# Altium project PCB_Project.PrjPcb
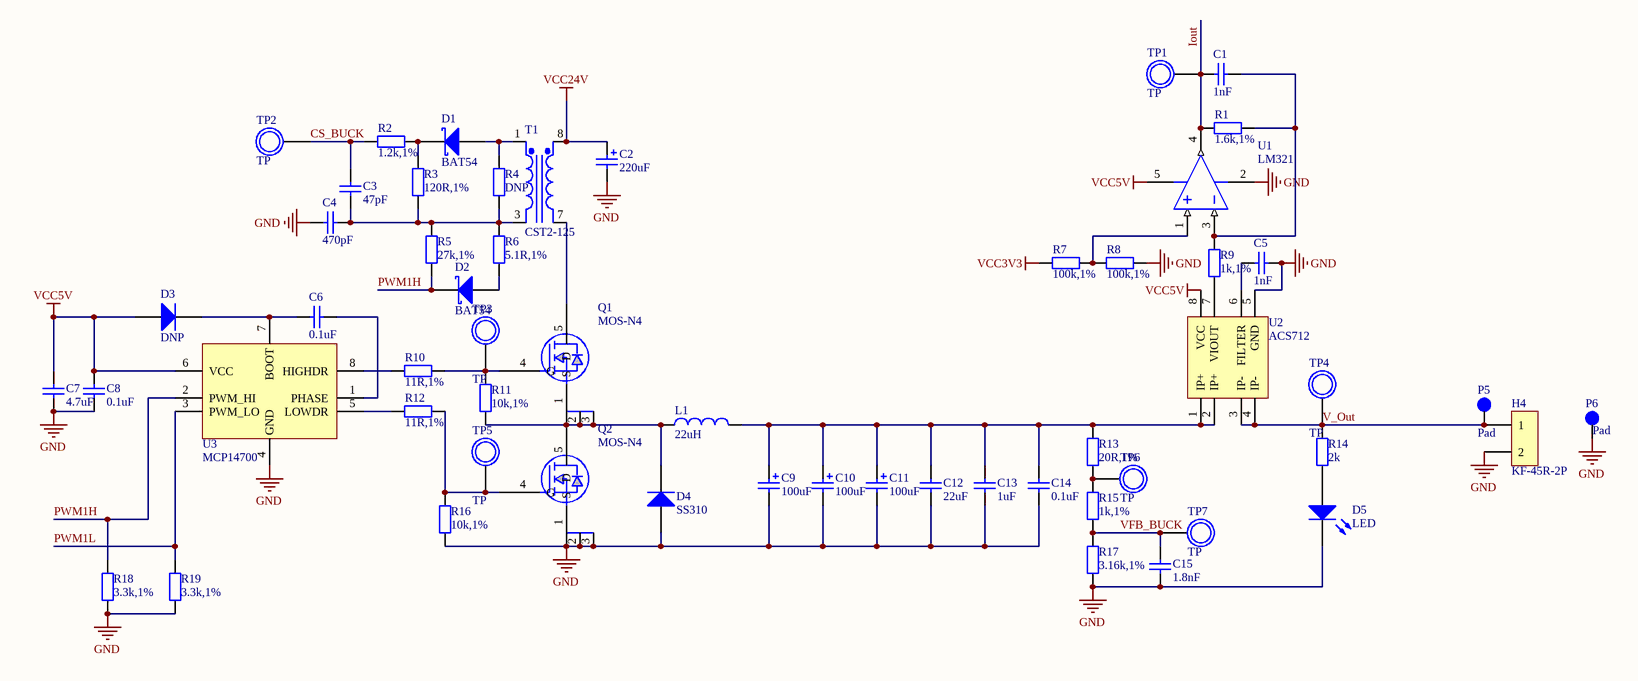
[diagram p0: buck.SchDoc]
2 sheets, 99 parts. Net scope: global (net labels, ports and power ports of the same name join across sheets).
Board file: BuckConverter.PcbDoc
Sheets:
  buck.SchDoc
  dsPIC33EP.SchDoc

## Sheet buck.SchDoc
size A3

### Parts
C1  1nF  [CAP0603]
C2  220uF  [CAPAE109103X105N]
C3  47pF  [CAP0603]
C4  470pF  [CAP0603]
C5  1nF  [CAP0603]
C6  0.1uF  [CAP0603]
C7  4.7uF  [CAP0603]
C8  0.1uF  [CAP0603]
C9  100uF  [CAPAE8983X105N]
C10  100uF  [CAPAE8983X105N]
C11  100uF  [CAPAE8983X105N]
C12  22uF  [CAP1206]
C13  1uF  [CAP1206]
C14  0.1uF  [CAP1206]
C15  1.8nF  [CAP0603]
D1  BAT54  [SOD250X100-2N]
D2  BAT54  [SOD250X100-2N]
D3  DNP  [SMA]
D4  SS310  [SMA]
D5  LED  [LED0402]
H4  KF-45R-2P  [KF-45R-2P]
L1  22uH  [CDRH125]
P5  Pad  [PAD10x50]
P6  Pad  [PAD10x50]
Q1  MOS-N4  [QFN5x6]
Q2  MOS-N4  [QFN5x6]
R1  1.6k,1%  [RES0603]
R2  1.2k,1%  [RES0603]
R3  120R,1%  [RES0603]
R4  DNP  [RES0603]
R5  27k,1%  [RES0603]
R6  5.1R,1%  [RES0603]
R7  100k,1%  [RES0603]
R8  100k,1%  [RES0603]
R9  1k,1%  [RES0603]
R10  11R,1%  [RES0603]
R11  10k,1%  [RES0603]
R12  11R,1%  [RES0603]
R13  20R,1%  [RES0603]
R14  2k  [RES0402]
R15  1k,1%  [RES0603]
R16  10k,1%  [RES0603]
R17  3.16k,1%  [RES0603]
R18  3.3k,1%  [RES0603]
R19  3.3k,1%  [RES0603]
T1  CST2-125  [CST2-125]
TP1  TP  [PAD85R]
TP2  TP  [PAD85R]
TP3  TP  [PAD85R]
TP4  TP  [PAD85R]
TP5  TP  [PAD85R]
TP6  TP  [PAD85R]
TP7  TP  [PAD85R]
U1  LM321  [SOT65P210X110-5N]
U2  ACS712  [SOP127P600X175-8N]
U3  MCP14700  [SOP127P600X175-8N]

### Nets
GND: C2.1 C4.2 C5.1 C7.1 C8.1 C9.1 C10.1 C11.1 C12.1 C13.1 C14.1 C15.1 D4.1(A) D5.2(K) H4.2 P6.1 Q2.1(S) Q2.2 Q2.3 R8.1 R16.2 R17.2 R18.1 R19.1 U1.2(V-) U2.5(GND) U3.4(GND)
VCC3V3: R7.2
VCC5V: C7.2 C8.2 D3.1(A) U1.5(V+) U2.8(VCC) U3.6(VCC)
VCC24V: C2.2 T1.8(Pri+)
CS_BUCK: C3.2 R2.2 TP2.1
Iout: C1.2 R1.1 TP1.1 U1.4(OUT)
PWM1H: D2.1(K) R5.2 R18.2 U3.2(PWM_HI)
PWM1L: R19.2 U3.3(PWM_LO)
V_Out: H4.1 P5.1 R14.2 TP4.1 U2.3(IP-) U2.4(IP-)
VFB_BUCK: C15.2 R15.2 R17.1 TP7.1
NetC1_1: C1.1 R1.2 R9.1 U1.3(IN-)
NetC3_1: C3.1 C4.1 R3.2 R4.1 R5.1 R6.1 T1.3(Sec-)
NetC5_2: C5.2 U2.6(FILTER)
NetC6_1: C6.1 U3.1(PHASE)
NetC6_2: C6.2 D3.2(K) U3.7(BOOT)
NetC9_2: C9.2 C10.2 C11.2 C12.2 C13.2 C14.2 L1.2 R13.1 U2.1(IP+) U2.2(IP+)
NetD1_1: D1.1(K) R2.1 R3.1
NetD1_2: D1.2(A) R4.2 T1.1(Sec+)
NetD2_2: D2.2(A) R6.2
NetD4_2: D4.2(K) L1.1 Q1.1(S) Q1.2 Q1.3 Q2.5(D) R11.2
NetD5_1: D5.1(A) R14.1
NetQ1_4: Q1.4(G) R10.1 R11.1 TP3.1
NetQ1_5: Q1.5(D) T1.7(Pri-)
NetQ2_4: Q2.4(G) R12.1 R16.1 TP5.1
NetR7_1: R7.1 R8.2 U1.1(IN+)
NetR9_2: R9.2 U2.7(VIOUT)
NetR10_2: R10.2 U3.8(HIGHDR)
NetR12_2: R12.2 U3.5(LOWDR)
NetR13_2: R13.2 R15.1 TP6.1

### Library data of the parts
C1 C3-C5 C7 C12 C13 C15 = CAP: CAP NON-POL; Tolerance: +/-10%; Rated Voltage: 50V; Capacitance Value: 0.1uF
C2 C9-C11 = CAP_Pol: cap pol; Tolerance: +\- 10%; Capacitance Value: 47uF; Rated Voltage: 50V
C6 C8 C14 = CAP: CAP NON-POL; Tolerance: +/-10%; Rated Voltage: 50V; Capacitance Value: 0.1uF
D1 D2 = Diode Schottky: Schottky Diode
D3 D4 = Diode
L1 = Inductor
Q1 Q2 = MOS-N4: N Channel MOSFET
R1-R19 = RES
T1 = CST2-125: Current Transformer 1:125
TP1-TP7 = Test_Point: test point
U1 = LM321: Low Power Single Op Amp
U2 = ACS712: Fully Integrated, Hall Effect-Based Linear Current Sensor with 2.1 kVRMS Voltage Isolation and a Low-Resistance Current Conductor
U3 = MCP14700: Dual Input Synchronous MOSFET Driver

## Sheet dsPIC33EP.SchDoc
size A3
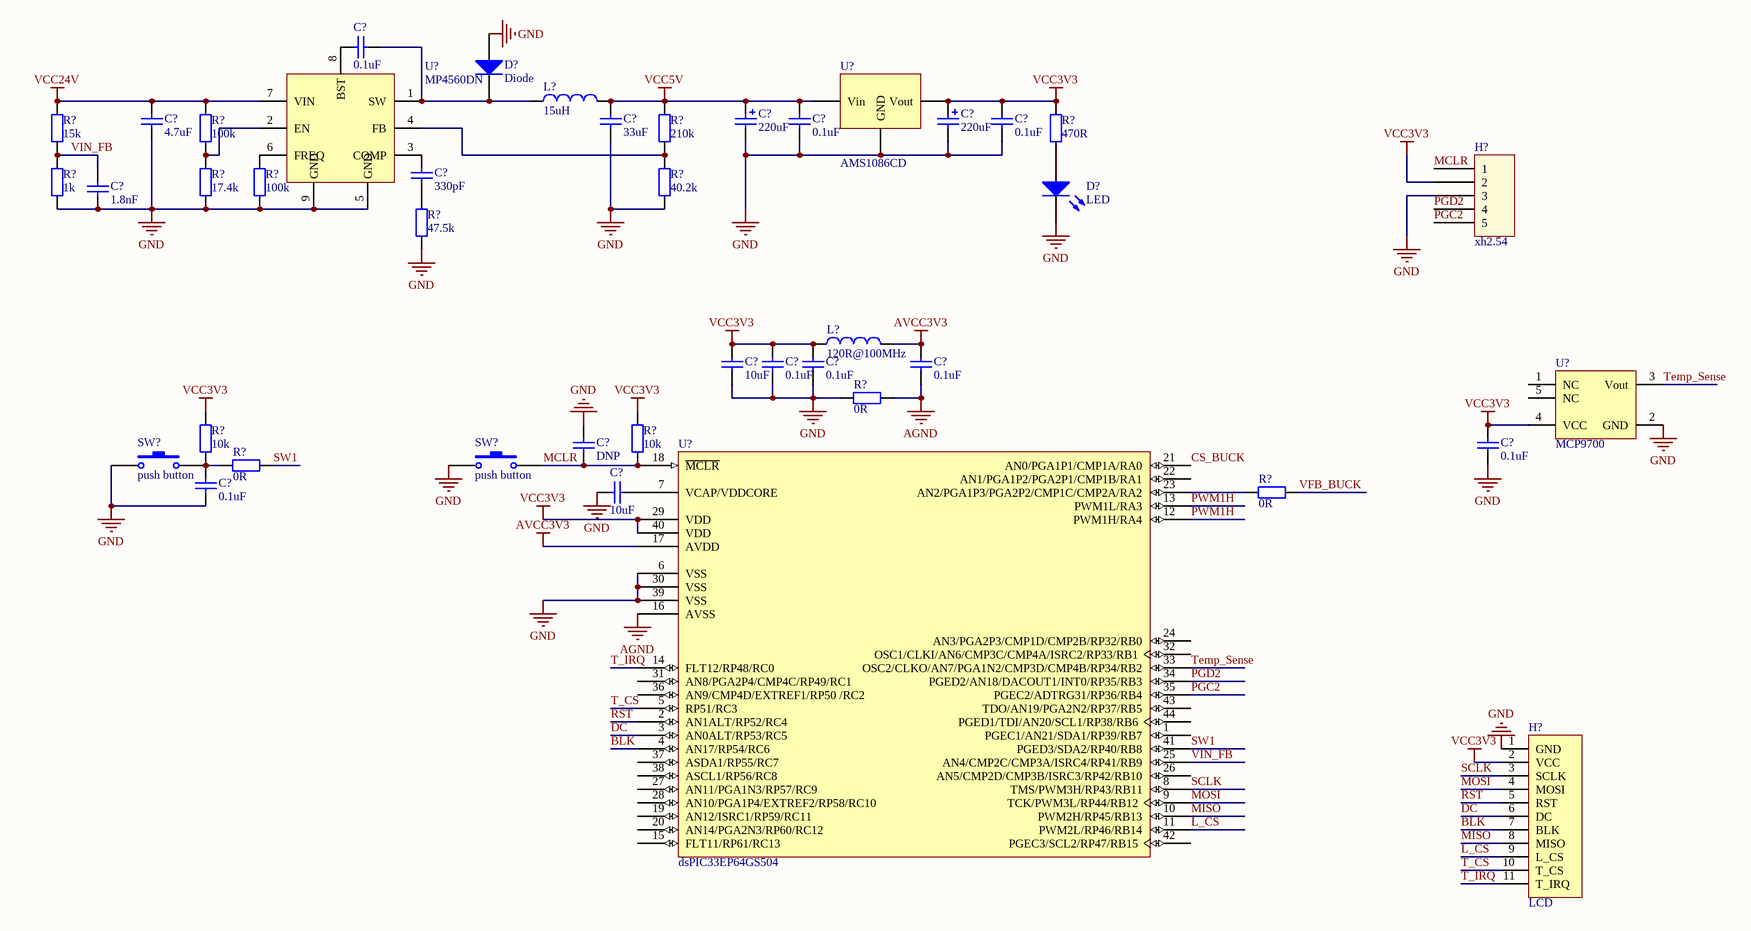
[diagram p1: dsPIC33EP.SchDoc]

### Parts
(Parts that share a designator on the sheet are numbered #1, #2 ... from top to bottom, then left to right.)
C?#1  0.1uF  [CAP0402]
C?#2  33uF  [CAP0402]
C?#3  220uF  [CAPAE109103X105N]
C?#4  0.1uF  [CAP1206]
C?#5  220uF  [CAPAE109103X105N]
C?#6  0.1uF  [CAP1206]
C?#7  4.7uF  [CAP0402]
C?#8  330pF  [CAP0402]
C?#9  1.8nF  [CAP0402]
C?#10  10uF  [CAP0603]
C?#11  0.1uF  [CAP0603]
C?#12  0.1uF  [CAP0603]
C?#13  0.1uF  [CAP0603]
C?#14  DNP  [CAP0603]
C?#15  0.1uF  [CAP1206]
C?#16  0.1uF  [CAP0603]
C?#17  10uF  [CAP0603]
D?#1  Diode  [DIOM5436X26N]
D?#2  LED  [LED0603]
H?#1  xh2.54  [XH2.54_5A]
H?#2  LCD  [LCD-2.4']
L?#1  15uH  [INDM104103X40N]
L?#2  120R@100MHz  [CDRH125]
R?#1  15k  [RES0603]
R?#2  100k  [RES0603]
R?#3  210k  [RES0603]
R?#4  470R  [RES0603]
R?#5  1k  [RES0603]
R?#6  17.4k  [RES0603]
R?#7  100k  [RES0603]
R?#8  40.2k  [RES0603]
R?#9  47.5k  [RES0603]
R?#10  0R  [RES1206]
R?#11  10k  [RES0603]
R?#12  10k  [RES0603]
R?#13  0R  [RES0603]
R?#14  0R  [RES1206]
SW?#1  push button  [SW-PB SMD]
SW?#2  push button  [SW-PB SMD]
U?#1  AMS1086CD  [DPAK228P1003X238-3N]
U?#2  MP4560DN  [SOIC127P600X175_HS-9N]
U?#3  MCP9700  [SOT65P210X110-5N]
U?#4  dsPIC33EP64GS504  [TQFP-PT44_M]

### Nets
AGND: C?#13.1 R?#10.2 U?#4.16(AVSS)
AVCC3V3: C?#13.2 L?#2.2 U?#4.17(AVDD)
GND: C?#2.2 C?#3.1 C?#4.2 C?#5.1 C?#6.2 C?#7.1 C?#9.1 C?#10.1 C?#11.1 C?#12.1 C?#14.1 C?#15.2 C?#16.2 C?#17.2 D?#1.1(A) D?#2.2(K) H?#1.3 H?#2.1(GND) R?#5.1 R?#6.1 R?#7.1 R?#8.2 R?#9.1 R?#10.1 SW?#1.1 SW?#2.1 U?#1.1(GND) U?#2.5(GND) U?#2.9(GND) U?#3.2(GND) U?#4.6(VSS) U?#4.30(VSS) U?#4.39(VSS)
VCC3V3: C?#5.2 C?#6.1 C?#10.2 C?#11.2 C?#12.2 C?#15.1 H?#1.2 H?#2.2(VCC) L?#2.1 R?#4.2 R?#11.1 R?#12.1 U?#1.2(Vout) U?#3.4(VCC) U?#4.29(VDD) U?#4.40(VDD)
VCC5V: C?#2.1 C?#3.2 C?#4.1 L?#1.2 R?#3.1 U?#1.3(Vin)
VCC24V: C?#7.2 R?#1.2 R?#2.2 U?#2.7(VIN)
BLK: H?#2.7(BLK) U?#4.4(AN17/RP54/RC6)
CS_BUCK: U?#4.21(AN0/PGA1P1/CMP1A/RA0)
DC: H?#2.6(DC) U?#4.3(AN0ALT/RP53/RC5)
L_CS: H?#2.9(L_CS) U?#4.11(PWM2L/RP46/RB14)
MCLR: C?#14.2 H?#1.1 R?#12.2 SW?#2.2 U?#4.18(~{MCLR})
MISO: H?#2.8(MISO) U?#4.10(PWM2H/RP45/RB13)
MOSI: H?#2.4(MOSI) U?#4.9(TCK/PWM3L/RP44/RB12)
PGC2: H?#1.5 U?#4.35(PGEC2/ADTRG31/RP36/RB4)
PGD2: H?#1.4 U?#4.34(PGED2/AN18/DACOUT1/INT0/RP35/RB3)
PWM1H: U?#4.12(PWM1H/RA4) U?#4.13(PWM1L/RA3)
RST: H?#2.5(RST) U?#4.2(AN1ALT/RP52/RC4)
SCLK: H?#2.3(SCLK) U?#4.8(TMS/PWM3H/RP43/RB11)
SW1: R?#13.2 U?#4.41(PGED3/SDA2/RP40/RB8)
T_CS: H?#2.10(T_CS) U?#4.5(RP51/RC3)
T_IRQ: H?#2.11(T_IRQ) U?#4.14(FLT12/RP48/RC0)
Temp_Sense: U?#3.3(Vout) U?#4.33(OSC2/CLKO/AN7/PGA1N2/CMP3D/CMP4B/RP34/RB2)
VFB_BUCK: R?#14.2
VIN_FB: C?#9.2 R?#1.1 R?#5.2 U?#4.25(AN4/CMP2C/CMP3A/ISRC4/RP41/RB9)
NetC?#1_1: C?#1.1 D?#1.2(K) L?#1.1 U?#2.1(SW)
NetC?#1_2: C?#1.2 U?#2.8(BST)
NetC?#8_1: C?#8.1 U?#2.3(COMP)
NetC?#8_2: C?#8.2 R?#9.2
NetC?#16_1: C?#16.1 R?#11.2 R?#13.1 SW?#1.2
NetC?#17_1: C?#17.1 U?#4.7(VCAP/VDDCORE)
NetD?#2_1: D?#2.1(A) R?#4.1
NetR?#2_1: R?#2.1 R?#6.2 U?#2.2(EN)
NetR?#3_2: R?#3.2 R?#8.1 U?#2.4(FB)
NetR?#7_2: R?#7.2 U?#2.6(FREQ)
NetR?#14_1: R?#14.1 U?#4.23(AN2/PGA1P3/PGA2P2/CMP1C/CMP2A/RA2)

Not connected (* = marked no-connect by the designer): U?#3 1(NC) 5(NC); U?#4 1(PGEC1/AN21/SDA1/RP39/RB7) 15(FLT11/RP61/RC13) 19(AN12/ISRC1/RP59/RC11) 20(AN14/PGA2N3/RP60/RC12) 22(AN1/PGA1P2/PGA2P1/CMP1B/RA1) 24(AN3/PGA2P3/CMP1D/CMP2B/RP32/RB0) 26(AN5/CMP2D/CMP3B/ISRC3/RP42/RB10) 27(AN11/PGA1N3/RP57/RC9) 28(AN10/PGA1P4/EXTREF2/RP58/RC10) 31(AN8/PGA2P4/CMP4C/RP49/RC1) 32(OSC1/CLKI/AN6/CMP3C/CMP4A/ISRC2/RP33/RB1) 36(AN9/CMP4D/EXTREF1/RP50_/RC2) 37(ASDA1/RP55/RC7) 38(ASCL1/RP56/RC8) 42(PGEC3/SCL2/RP47/RB15) 43(TDO/AN19/PGA2N2/RP37/RB5) 44(PGED1/TDI/AN20/SCL1/RP38/RB6)

### Library data of the parts
C?#1 C?#4 C?#6 C?#11-C?#13 C?#15 C?#16 = CAP: as C6 on sheet buck; Capacitance Value: 0.1uF
C?#2 C?#7-C?#10 C?#14 C?#17 = CAP: as C1 on sheet buck
C?#3 C?#5 = CAP_Pol: as C2 on sheet buck
H?#1 = XH2.54_5P: pitch2.54
H?#2 = LCD_2.4': 2.4' TFT Module
L?#1 L?#2 = Inductor
R?#1-R?#14 = RES
SW?#1 SW?#2 = SW-PB
U?#1 = AMS1086CD: LDO
U?#2 = MP4462: 3.5A, 4MHz, 36V STEP-DOWN CONVERTER
U?#3 = MCP9700: Low-Power Voltage Output Temperature Sensor

## Nets that join several sheets
GND: buck (27 pins), dsPIC33EP (33 pins)
VCC3V3: buck (R7.2), dsPIC33EP (16 pins)
VCC5V: buck (6 pins), dsPIC33EP (6 pins)
VCC24V: buck (C2.2 T1.8), dsPIC33EP (C?#7.2 R?#1.2 R?#2.2 U?#2.7)
CS_BUCK: buck (C3.2 R2.2 TP2.1), dsPIC33EP (U?#4.21)
PWM1H: buck (D2.1 R5.2 R18.2 U3.2), dsPIC33EP (U?#4.12 U?#4.13)
VFB_BUCK: buck (C15.2 R15.2 R17.1 TP7.1), dsPIC33EP (R?#14.2)